# EAGLE design fuse board (EAGLE 9.6.2)
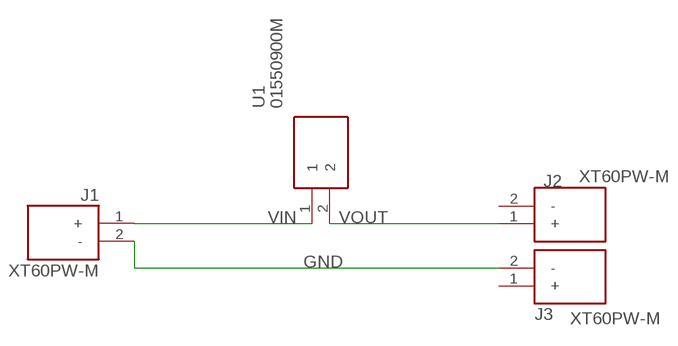
[diagram p0: schematic, sheet 1]

## Parts
J1  XT60PW-M  [AMASS_XT60PW-M]
J2  XT60PW-M  [AMASS_XT60PW-M]
J3  XT60PW-M  [AMASS_XT60PW-M]
U1  01550900M  [0154.250DR]

## Nets
GND: J1.2(-) J3.2(-)
VIN: J1.1(+) U1.1
VOUT: J2.1(+) U1.2
Unconnected: J2.2(-) J3.1(+)

## Library data of the parts
J1-J3 = XT60PW-M:XT60PW-M: Check availability <https://pricing.snapeda.com/parts/XT60PW-M/AMASS/view-part?ref=eda>; AVAILABILITY: Not in stock; DESCRIPTION: Socket, DC supply, male, PIN: 2; MF: AMASS; MP: XT60PW-M; PACKAGE: Package; PRICE: None
U1 = 01550900M:01550900M: LITTELFUSE - 01550900M. - BULK / ACS NANO FUSEHLDR 79M5625 Source: Datasheet <http://www.littelfuse.com/~/media/electronics/datasheets/fuses/littelfuse_fuse_154_154t_154l_154tl_datasheet.pdf.pdf>; ARROW_PART_NUMBER: 01550900M; ARROW_PRICE-STOCK: https://www.arrow.com/en/products/01550900m/littelfuse?region=europe; DESCRIPTION: LITTELFUSE - 01550900M. - BULK / ACS NANO FUSEHLDR 79M5625; HEIGHT: mm; MANUFACTURER_NAME: LITTELFUSE; MANUFACTURER_PART_NUMBER: 01550900M; MOUSER_PART_NUMBER: 576-01550900M; MOUSER_PRICE-STOCK: https://www.mouser.co.uk/ProductDetail/Littelfuse/01550900M?qs=DDoybve0rC%252BTXq1hqi5X1g%3D%3D

## Board
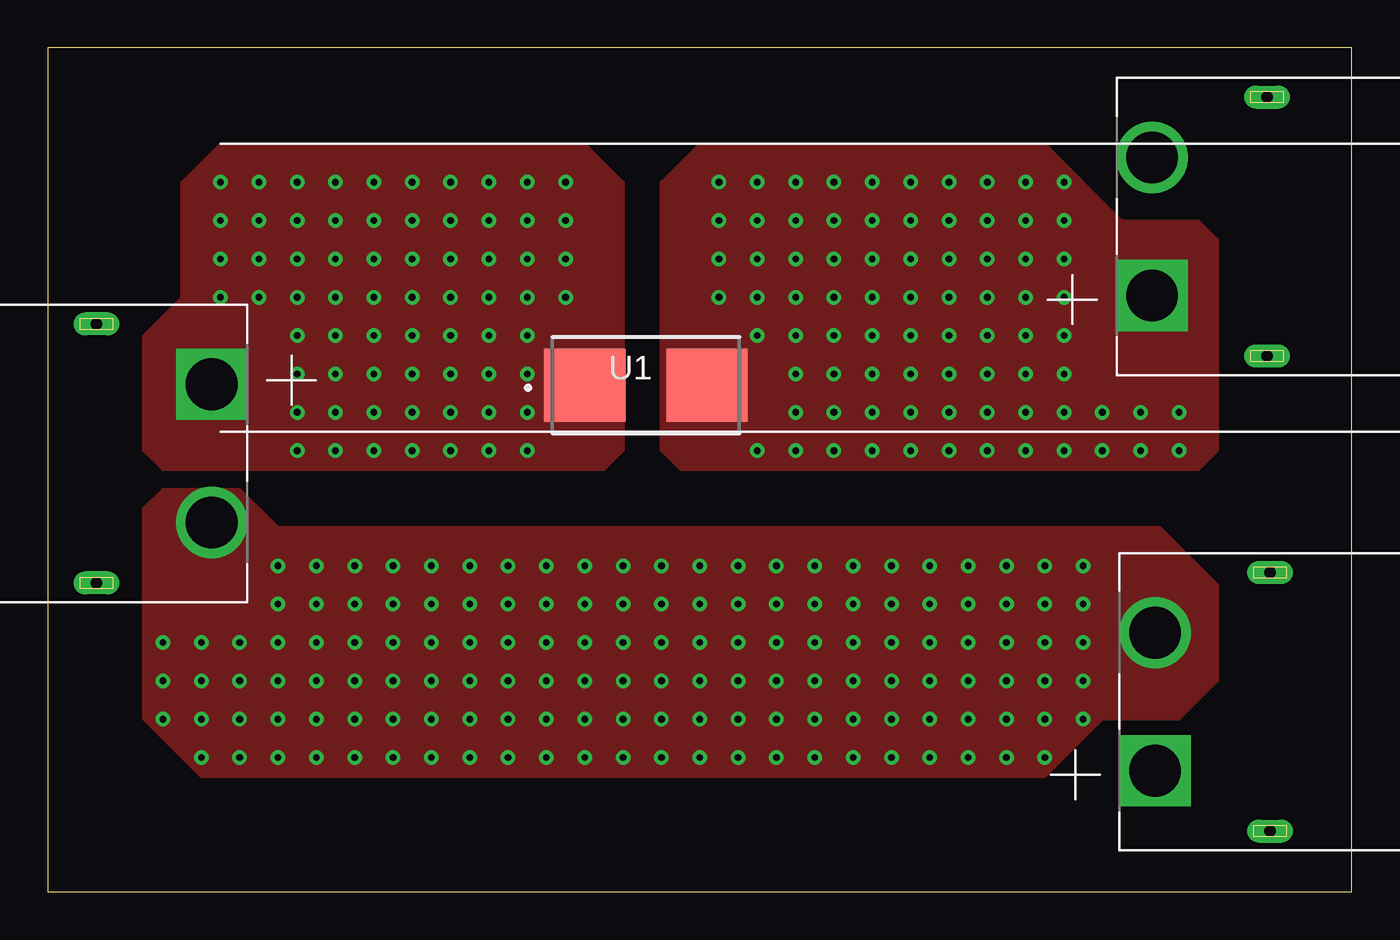
[diagram p1: board, top side]
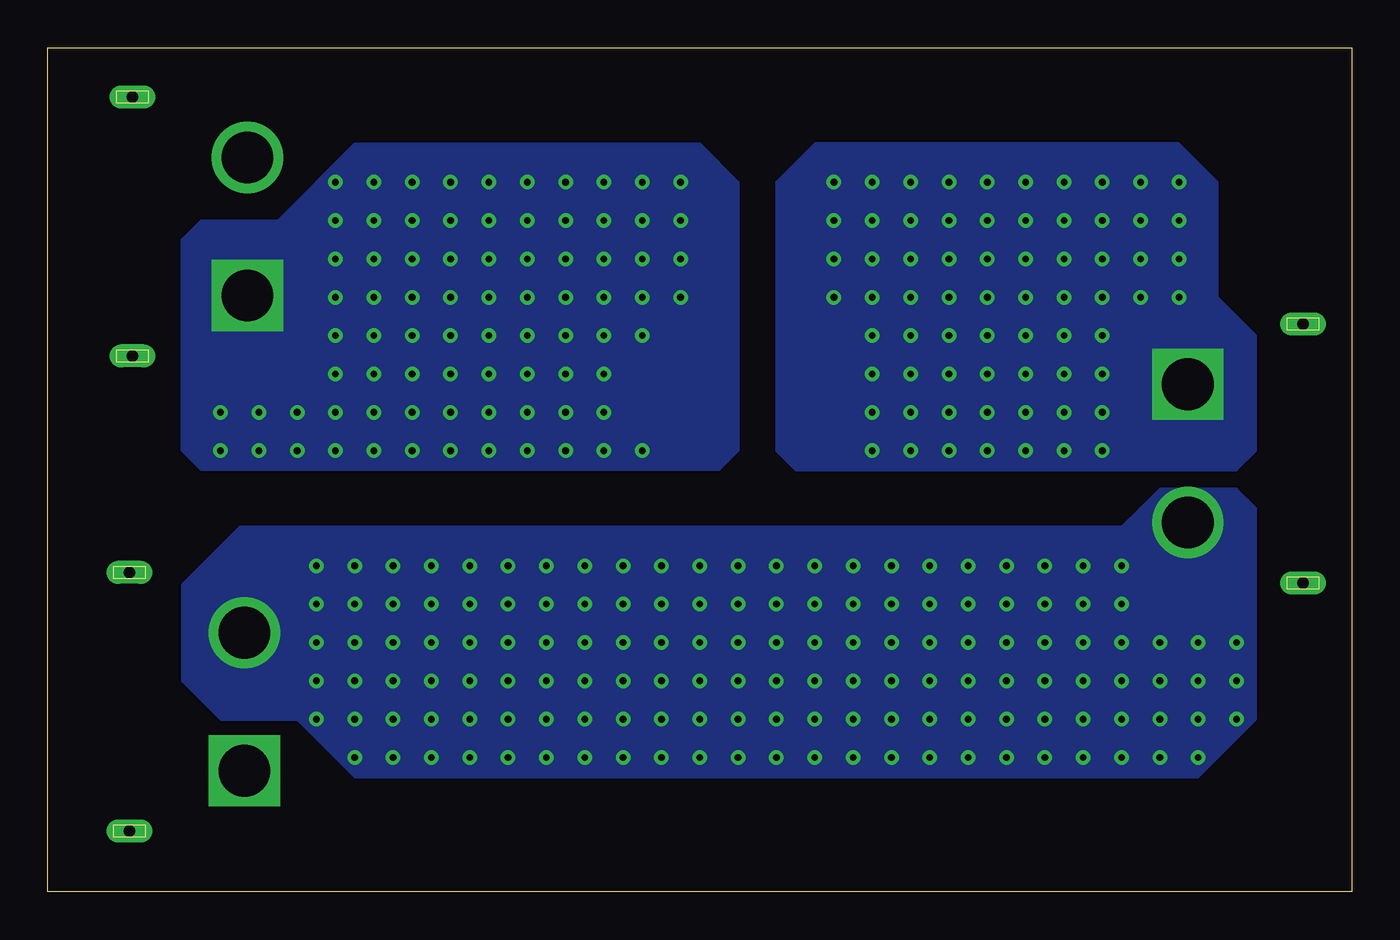
[diagram p2: board, bottom side, seen from below]

Size 68 x 44 mm. Coordinates in mm from the lower left corner, seen from the top.
Outline: 0,0 68,0 68,44 0,44 0,0
Copper layers (1*16): Top 0.035mm / dielectric 1.5mm / Bottom 0.035mm
Design rules "default": minimum track width 6mil, minimum drill 0.35mm, track to track 6mil, track to pad 6mil, pad to pad 6mil, via to via 6mil, smd to smd 6mil, copper to edge 40mil, drill to drill 6mil, minimum pad ring 10mil, minimum via ring 8mil, stop-mask expansion 4mil, vias tented up to drill 0mil, thermal gap 10mil

### Footprints (pad centres in the part's own frame; a part is rotated, then mirrored left to right if it is on the bottom)
AMASS_XT60PW-M = drill 2.7 square: 1 3.6,-6 | drill 2.7: 2 -3.6,-6 | drill 0.6 pad 1.2 long: S1 6.75,0; S2 -6.75,0
0154.250DR = smd 4.24 x 3.81: 1 -3.185,0; 2 3.185,0

### Placement (x,y rotation side)
J1  2.54,22.86 90 top
J2  63.6,34.69 270 top
J3  63.75,9.91 270 top
U1  31.19,26.42 0 top

### Tracks (layer width: path | path; a pad name or v marks a point on that pad's centre or on a via)
GND  (via drill 0.35)
  other vias: 6,13 8,13 10,13 12,13 6,11 8,11 10,11 12,11 12,9 10,9 8,9 6,9 8,7 10,7 12,7 14,7 16,7 18,7 20,7 22,7 24,7 26,7 28,7 30,7 32,7 34,7 36,7 38,7 40,7 42,7 44,7 46,7 48,7 50,7 52,7 14,13 14,11 14,9 16,11 16,13 16,9 18,13 18,11 18,9 20,9 20,11 20,13 20,15 18,15 16,15 14,15 12,15 12,17 14,17 16,17 18,17 20,17 22,17 24,17 26,17 28,17 30,17 32,17 34,17 36,17 38,17 40,17 42,17 44,17 46,17 48,17 50,17 52,17 54,17 54,15 54,13 54,11 54,9 52,9 52,11 52,13 52,15 50,15 50,13 50,11 50,9 48,9 48,11 48,13 48,15 46,15 46,13 46,11 46,9 44,15 44,13 44,11 44,9 42,9 42,11 42,13 42,15 40,15 40,13 40,11 40,9 38,9 38,11 38,13 38,15 36,15 34,15 32,15 30,15 28,15 26,15 24,15 22,15 22,13 22,11 22,9 24,9 24,11 24,13 26,13 26,11 26,9 28,9 28,11 28,13 30,13 32,13 32,13 34,13 36,13 36,11 36,9 34,9 34,11 32,11 32,9 30,9 30,11
  pour Bottom (no thermals): 6,21 10,21 11,20 12,19 18,19 58,19 60,17 61,16 61,11 59,9 55,9 52,6 8,6 5,9 5,20
  pour Top (no thermals): 5,20 6,21 10,21 12,19 58,19 61,16 61,11 59,9 55,9 52,6 8,6 5,9
VIN  (via drill 0.35)
  other vias: 9,37 11,37 13,37 15,37 17,37 19,37 21,37 23,37 25,37 27,37 9,35 11,35 13,35 15,35 17,35 19,35 21,35 23,35 25,35 27,35 9,33 11,33 13,33 15,33 17,33 19,33 21,33 23,33 25,33 27,33 9,31 11,31 13,31 15,31 17,31 19,31 21,31 23,31 25,31 27,31 13,29 13,27 13,25 13,23 15,23 15,25 15,27 15,29 17,29 17,27 17,25 17,23 19,23 19,25 19,27 19,29 21,29 21,27 21,25 21,23 23,23 23,25 23,27 23,29 25,29 25,27 25,25 25,23
  pour Top (no thermals): 5,24 5,29 7,31 7,37 9,39 28,39 29,38 30,37 30,24 30,23 29,22 6,22 5,23
  pour Bottom (no thermals): 5,23 5,29 7,31 7,37 9,39 28,39 30,37 30,23 29,22 6,22
VOUT  (via drill 0.35)
  other vias: 35,37 37,37 39,37 41,37 43,37 45,37 47,37 47,37 49,37 51,37 53,37 53,35 51,35 49,35 47,35 45,35 43,35 41,35 39,35 37,35 35,35 35,33 35,31 37,31 37,33 39,33 39,31 41,31 41,33 43,33 43,31 45,31 45,33 47,33 47,31 49,31 49,33 51,33 51,31 53,33 53,31 53,29 53,27 53,25 53,23 51,23 51,25 51,27 51,29 49,29 49,27 49,25 49,23 47,23 47,25 47,27 47,29 45,29 45,27 45,25 45,23 43,23 43,25 43,27 43,29 41,29 41,27 41,25 41,23 39,23 39,25 39,27 39,29 37,29 37,23 55,25 57,25 59,25 59,23 57,23 55,23
  pour Top (no thermals): 32,23 32,37 34,39 52,39 56,35 60,35 61,34 61,23 60,22 33,22
  pour Bottom (no thermals): 32,37 32,23 33,22 60,22 61,23 61,34 60,35 56,35 52,39 34,39